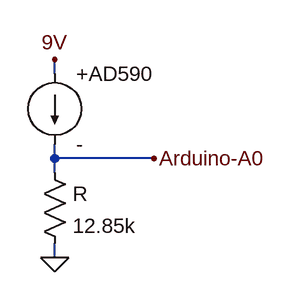
[diagram p0: schematic AD590.asc]
AD590.asc, the LTspice schematic file:
Version 4
SHEET 1 880 680
WIRE 32 96 32 80
WIRE 32 192 32 176
WIRE 144 192 32 192
WIRE 32 208 32 192
WIRE 32 304 32 288
FLAG 32 304 0
FLAG 32 80 9V
FLAG 144 192 Arduino-A0
SYMBOL current 32 96 R0
WINDOW 123 0 0 Left 2
WINDOW 39 0 0 Left 2
SYMATTR InstName +AD590
SYMATTR Value -
SYMBOL res 16 192 R0
SYMATTR InstName R
SYMATTR Value 12.85k

The netlist it stands for:
* AD590.asc
I§+AD590 9V Arduino-A0 -
R Arduino-A0 0 12.85k
.backanno
.end